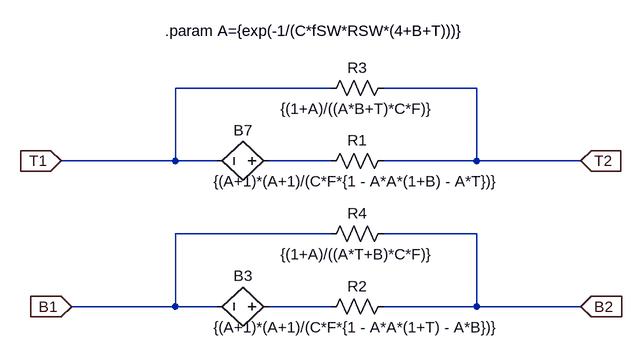
[diagram p0: schematic 4term_model_EQ.asc]
4term_model_EQ.asc, the LTspice schematic file:
Version 4
SHEET 1 2172 680
WIRE 928 -256 688 -256
WIRE 1152 -256 1008 -256
WIRE 688 -144 688 -256
WIRE 688 -144 512 -144
WIRE 752 -144 688 -144
WIRE 928 -144 832 -144
WIRE 1152 -144 1152 -256
WIRE 1152 -144 1008 -144
WIRE 1312 -144 1152 -144
WIRE 928 -32 688 -32
WIRE 1152 -32 1008 -32
WIRE 688 80 688 -32
WIRE 688 80 528 80
WIRE 752 80 688 80
WIRE 928 80 832 80
WIRE 1152 80 1152 -32
WIRE 1152 80 1008 80
WIRE 1312 80 1152 80
FLAG 528 80 B1
IOPIN 528 80 In
FLAG 1312 80 B2
IOPIN 1312 80 In
FLAG 512 -144 T1
IOPIN 512 -144 In
FLAG 1312 -144 T2
IOPIN 1312 -144 In
SYMBOL bv 848 80 R90
WINDOW 0 -32 56 VBottom 2
WINDOW 3 32 56 Invisible 2
SYMATTR InstName B3
SYMATTR Value V=(V(T2) - V(T1))
SYMBOL res 1024 -160 R90
WINDOW 0 0 56 VBottom 2
WINDOW 3 32 56 VTop 2
SYMATTR InstName R1
SYMATTR Value {(A+1)*(A+1)/(C*F*{1 - A*A*(1+B) - A*T})}
SYMBOL bv 848 -144 R90
WINDOW 0 -32 56 VBottom 2
WINDOW 3 32 56 Invisible 2
SYMATTR InstName B7
SYMATTR Value V=(V(B2) - V(B1))
SYMBOL res 1024 -272 R90
WINDOW 0 0 56 VBottom 2
WINDOW 3 32 56 VTop 2
SYMATTR InstName R3
SYMATTR Value {(1+A)/((A*B+T)*C*F)}
SYMBOL res 1024 -48 R90
WINDOW 0 0 56 VBottom 2
WINDOW 3 32 56 VTop 2
SYMATTR InstName R4
SYMATTR Value {(1+A)/((A*T+B)*C*F)}
SYMBOL res 1024 64 R90
WINDOW 0 0 56 VBottom 2
WINDOW 3 32 56 VTop 2
SYMATTR InstName R2
SYMATTR Value {(A+1)*(A+1)/(C*F*{1 - A*A*(1+T) - A*B})}
TEXT 672 -344 Left 2 !.param A={exp(-1/(C*fSW*RSW*(4+B+T)))}

The netlist it stands for:
* 4term_model_EQ.asc
B3 N002 B1 V=(V(T2) - V(T1))
R1 T2 N001 {(A+1)*(A+1)/(C*F*{1 - A*A*(1+B) - A*T})}
B7 N001 T1 V=(V(B2) - V(B1))
R3 T2 T1 {(1+A)/((A*B+T)*C*F)}
R4 B2 B1 {(1+A)/((A*T+B)*C*F)}
R2 B2 N002 {(A+1)*(A+1)/(C*F*{1 - A*A*(1+T) - A*B})}
.param A={exp(-1/(C*fSW*RSW*(4+B+T)))}
.backanno
.end